# Altium project SAMV71_Xplained_Ultra.PrjPCB (part 4 of 4)

## Sheet SAMV71_Xplained_Ultra_MCU_Peripherals.SchDoc: Target MCU Peripherals
size A3; Organization: ATMEL Norway; Address1: Vestre Rosten 79; Address2: N-7075 TILLER; Address3: NORWAY; DocumentNumber: A09-2407; Revision: 11; SheetNumber: 6; SheetTotal: 13; DrawnBy: Microchip Norway; Engineer: AH; PageSetup: Record=PageOptions|CenterHorizontal=True|CenterVertical=True|PrintScale=1.01|XCorrection=1.00|YCorrection=1.00|PrintKind=1|BorderSize=5000000|LeftOffset=0|BottomOffset=0|Orientation=2|PaperLength=1000|PaperWidth=1000|Scale=100|PaperSource=7|PrintQuality=-4|MediaType=1|DitherType=10|PaperKind=A3 (297 x 420 mm)|PrintScaleMode=1; ProjectTitle: SAM V71 Xplained Ultra; PCBNumber: A08-2216; PCBRevision: 4
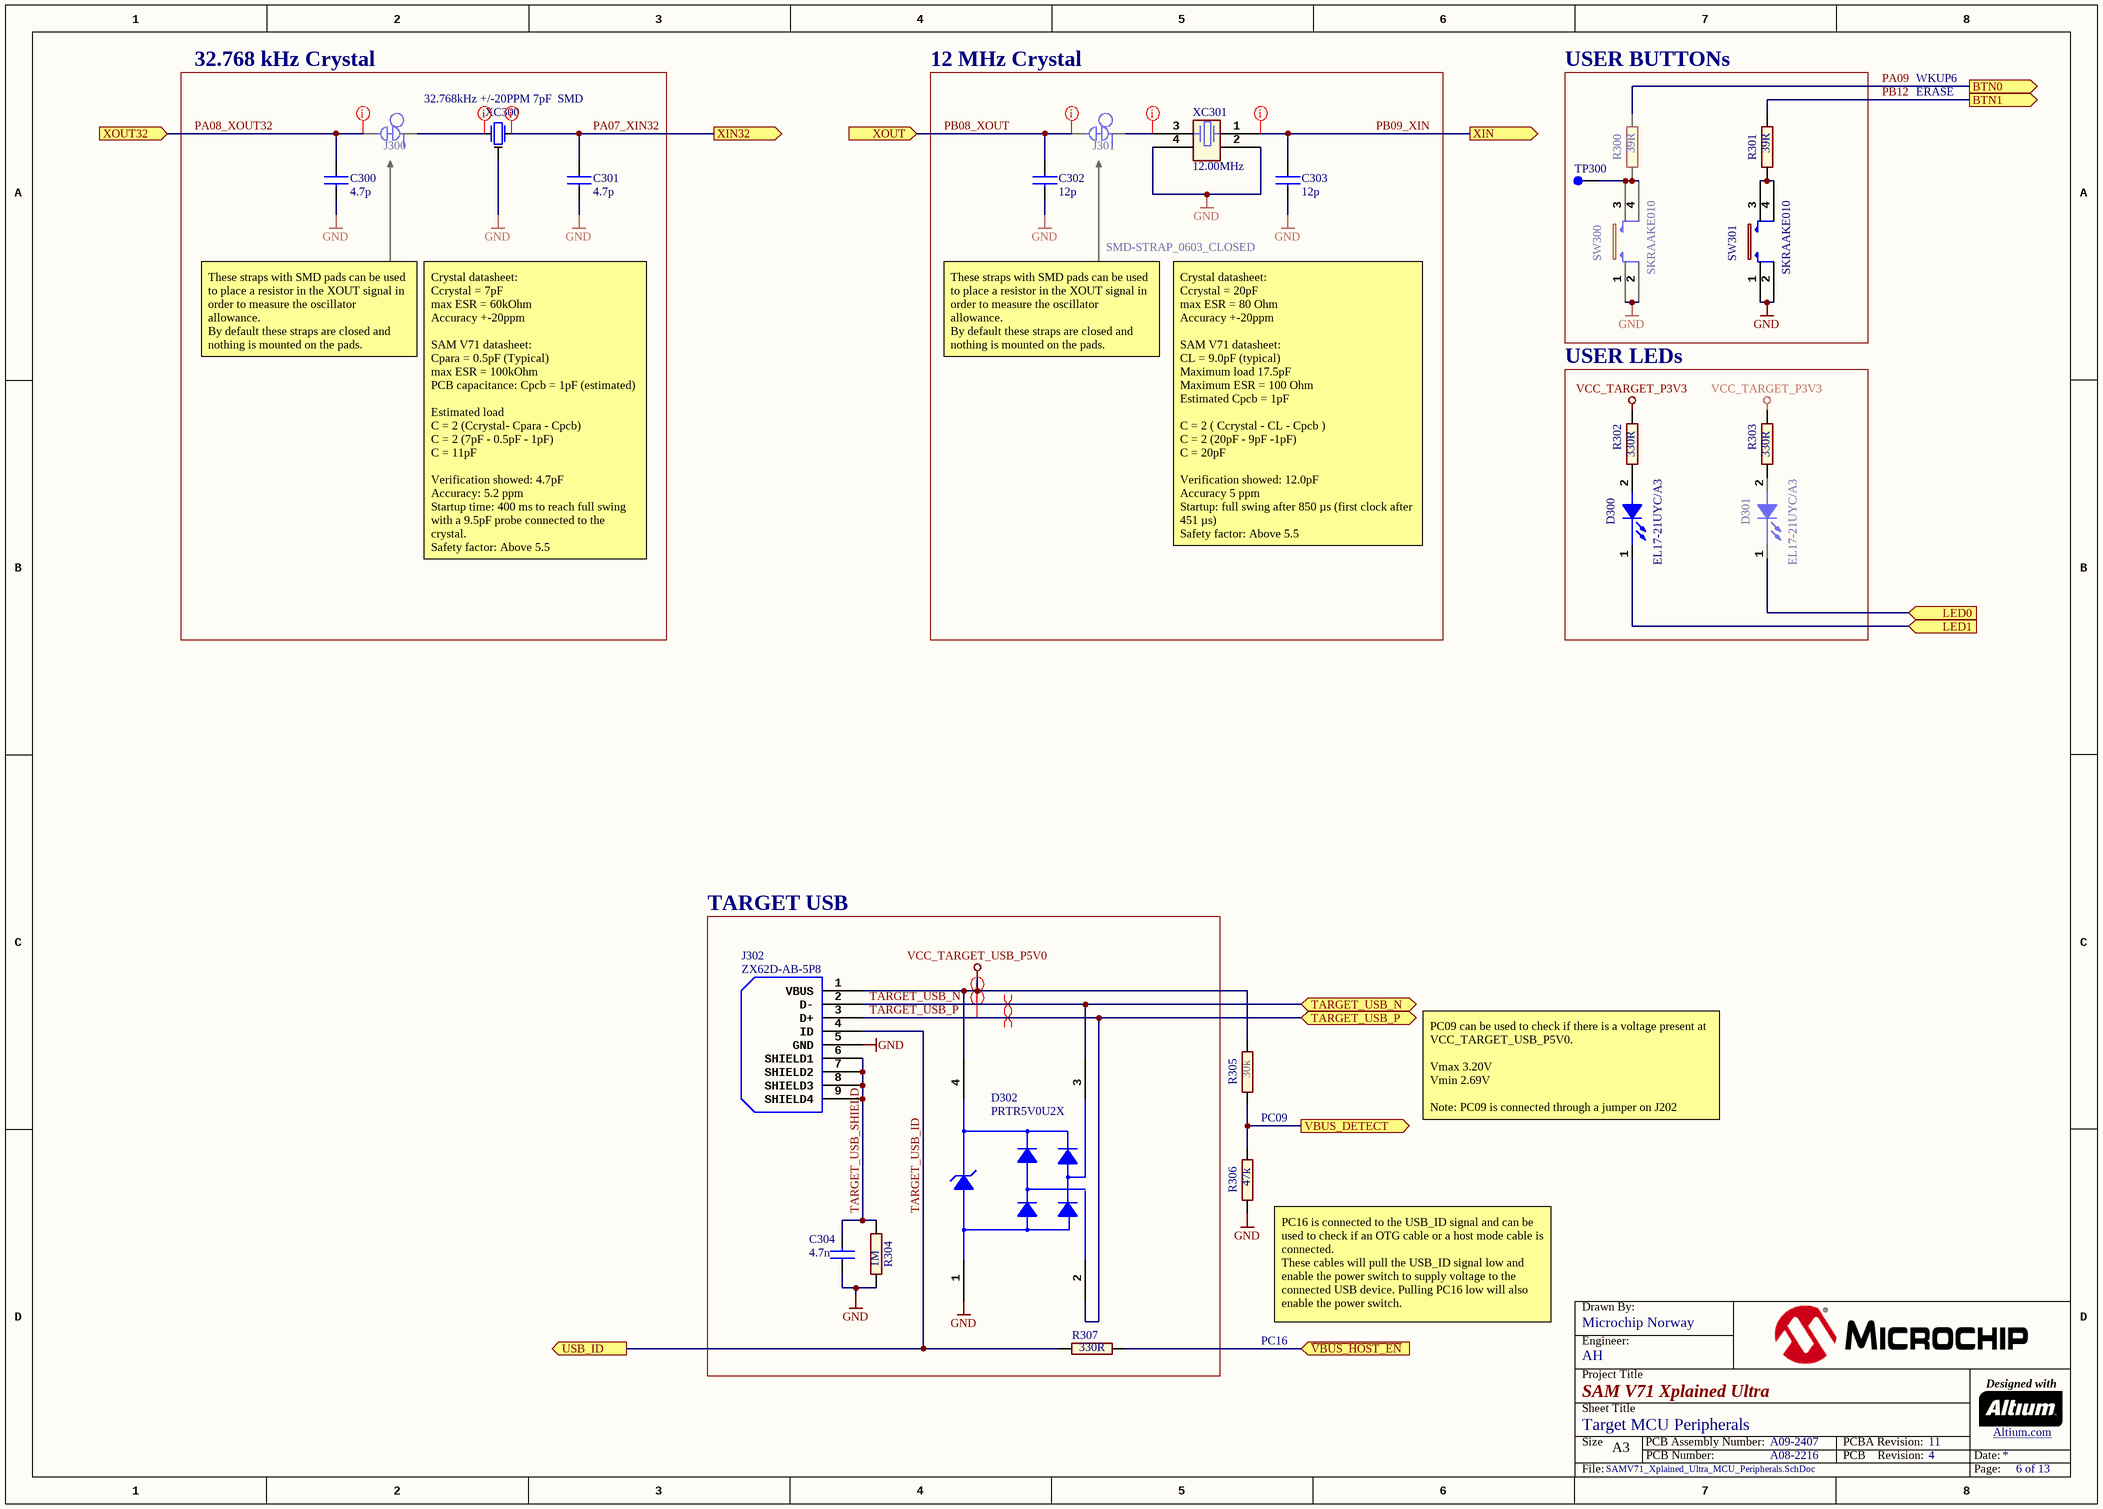
[diagram p11: SAMV71_Xplained_Ultra_MCU_Peripherals.SchDoc]

### Parts
C300  value 4.7p  [AP1-00001]
C301  value 4.7p  [AP1-00001]
C302  value 12p  [AP1-00001]
C303  value 12p  [AP1-00001]
C304  value 4.7n  [AP1-00053]
D300  value EL17-21UYC/A3  [AP4-00013]
D301  value EL17-21UYC/A3  [AP4-00013]
D302  value PRTR5V0U2X  [AP4-00001]
J300  (no value)  [AP9-00044]  (net tie, no BOM)
J301  value SMD-STRAP_0603_CLOSED  [AP9-00044]  (net tie, no BOM)
J302  value ZX62D-AB-5P8  [AP8-00852]  (hidden comment: 2,000 pieces per reel)
R300  value 39R  [AP2-00011]
R301  value 39R  [AP2-00011]
R302  value 330R  [AP2-00000]
R303  value 330R  [AP2-00000]
R304  value 1M  [AP2-00011]
R305  value 30k  [AP2-00000]
R306  value 47k  [AP2-00000]
R307  value 330R  [AP2-00000]
SW300  value SKRAAKE010  [AP8-00137]  (hidden comment: same as A08-0091 but less force is needed; Can be ordered in low volumes from Mouser)
SW301  value SKRAAKE010  [AP8-00137]  (hidden comment: same as A08-0091 but less force is needed; Can be ordered in low volumes from Mouser)
TP300  (no value)  [AP8-00010]  (no BOM)
XC300  value 32.768kHz +/-20PPM 7pF  SMD  [AP7-00044]  (hidden comment: Farnell order no:1539364)
XC301  value 12.00MHz  [AP7-00039]

### Blocks framed on the sheet
32.768 kHz Crystal: C300 C301 J300 XC300
12 MHz Crystal: C302 C303 J301 XC301
USER BUTTONs: R300 R301 SW300 SW301 TP300
USER LEDs: D300 D301 R302 R303
TARGET USB: C304 D302 J302 R304 R307

### Ports
BTN0 (out), BTN1 (out), LED0 (in), LED1 (in), TARGET_USB_N (bidir), TARGET_USB_P (bidir), USB_ID (out), VBUS_DETECT (out), XIN32 (out), XIN (out), XOUT32 (in), XOUT (in), ~{VBUS_HOST_EN} (in)

### Nets
GND: C300.2 C301.2 C302.2 C303.2 C304.1 D302.1(GND) J302.5(GND) R304.1 R306.1 SW300.1 SW300.2 SW301.1 SW301.2 XC300.3 XC301.2 XC301.4
VCC_TARGET_P3V3: R302.2 R303.2
VCC_TARGET_USB_P5V0: D302.4(VCC) J302.1(VBUS) R305.2
PA07_XIN32: C301.1 XC300.2 ; port XIN32
PA08_XOUT32: C300.1 J300.2 ; port XOUT32
PA09: R300.2 ; port BTN0
PA23: D301.1(CATHODE) ; port LED0
PB08_XOUT: C302.1 J301.2 ; port XOUT
PB09_XIN: C303.1 XC301.1 ; port XIN
PB12: R301.2 ; port BTN1
PC09_LED: D300.1(CATHODE) ; port LED1
PC09_VBUS_DETECT: R305.1 R306.2 ; port VBUS_DETECT
PC16: R307.2 ; port ~{VBUS_HOST_EN}
TARGET_USB_ID: J302.4(ID) R307.1 ; port USB_ID
TARGET_USB_N: D302.3(I/O_2) J302.2(D-) ; port TARGET_USB_N
TARGET_USB_P: D302.2(I/O_1) J302.3(D+) ; port TARGET_USB_P
TARGET_USB_SHIELD: C304.2 J302.6(SHIELD1) J302.7(SHIELD2) J302.8(SHIELD3) J302.9(SHIELD4) R304.2
NetD300_2: D300.2(ANODE) R302.1
NetD301_2: D301.2(ANODE) R303.1
NetJ300_1: J300.1 XC300.1
NetJ301_1: J301.1 XC301.3
NetR300_1: R300.1 SW300.3 SW300.4 TP300.1
NetR301_1: R301.1 SW301.3 SW301.4

### Layout directives
differential pair: TARGET_USB_N, TARGET_USB_P
rule Assembly Testpoint Usage [Testpoint - Not Allowed    Multiple - Not Allowed]; rule Fabrication Testpoint Usage [Testpoint - Not Allowed    Multiple - Not Allowed]: NetJ300_1, NetJ301_1, PA07_XIN32, PA08_XOUT32, PB08_XOUT, PB09_XIN, TARGET_USB_N, TARGET_USB_P

### Notes on the sheet
- WKUP6
- ERASE
- These straps with SMD pads can be used to place a resistor in the XOUT signal in order to measure the oscillator allowance.
  By default these straps are closed and nothing is mounted on the pads.
- Crystal datasheet:
  Ccrystal = 7pF
  max ESR = 60kOhm
  Accuracy +-20ppm
  SAM V71 datasheet:
  Cpara = 0.5pF (Typical)
  max ESR = 100kOhm
  PCB capacitance: Cpcb = 1pF (estimated)
  Estimated load
  C = 2 (Ccrystal- Cpara - Cpcb)
  C = 2 (7pF - 0.5pF - 1pF)
  C = 11pF
  Verification showed: 4.7pF
  Accuracy: 5.2 ppm
  Startup time: 400 ms to reach full swing with a 9.5pF probe connected to the crystal.
  Safety factor: Above 5.5
- Crystal datasheet:
  Ccrystal = 20pF
  max ESR = 80 Ohm
  Accuracy +-20ppm
  SAM V71 datasheet:
  CL = 9.0pF (typical)
  Maximum load 17.5pF
  Maximum ESR = 100 Ohm
  Estimated Cpcb = 1pF
  C = 2 ( Ccrystal - CL - Cpcb )
  C = 2 (20pF - 9pF -1pF)
  C = 20pF
  Verification showed: 12.0pF
  Accuracy 5 ppm
  Startup: full swing after 850 µs (first clock after 451 µs)
  Safety factor: Above 5.5
- PC09
- PC09 can be used to check if there is a voltage present at VCC_TARGET_USB_P5V0.
  Vmax 3.20V
  Vmin 2.69V
  Note: PC09 is connected through a jumper on J202
- (near R306) PC16 is connected to the USB_ID signal and can be used to check if an OTG cable or a host mode cable is connected.
  These cables will pull the USB_ID signal low and enable the power switch to supply voltage to the connected USB device. Pulling PC16 low will also enable the power switch.
- PC16
- Drawn By:
- Project Title
- Engineer:
- Designed with
- Sheet Title
- Size
- A3
- PCB Number:
- PCB Assembly Number:
- PCBA Revision:
- PCB    Revision:
- Date:
- Altium.com <http://go.altium.com/MicrochipLandingPage_Evaluation.html>
- File:
- Page:

### Library data of the parts
C300 C301 = A01-0011: Ceramic capacitor, SMD 0402, NP0, 50V, +/-0.25pF; PartGroup: Capacitors,Ceramic,SMD 0402; Manufacturer: YAGEO CORP; MPN: CC0402CRNPO9BN4R7; TemperatureRange: -55 - +125 deg C; Status: Active; AN: A01-0011; Tolerance: 50V, +/-0.25pF; Height: 0,550000011920929
C302 C303 = A01-0016: Ceramic capacitor, SMD 0402, NP0, 50V, +/-5%; PartGroup: Capacitors,Ceramic,SMD 0402; Manufacturer: Kemet; MPN: C0402C120J5GAC7867; TemperatureRange: -55 - +125 deg C; Status: Active; AN: A01-0016; Tolerance: 50V, +/-5%; Height: 0,550000011920929
C304 = A01-0046: Ceramic capacitor, SMD 0402, X7R, 25V, +/-10%; PartGroup: Capacitors,Ceramic,SMD 0402; Manufacturer: PHYCOMP; MPN: 2238 587 15632; TemperatureRange: -55 - +125 deg C; Status: Active; AN: A01-0046; Tolerance: 25V, +/-10%; Height: 0,550000011920929
D300 D301 = A10-0019: LED, Yellow, Wave length=591nm, SMD 0805, ±70°; PartGroup: Opto,LEDs,SMD; Manufacturer: Everlight; MPN: 17-21UYC/S530-A3/TR8; TemperatureRange: -40 to +85 deg C; Status: Active; AN: A10-0019; Height: 1,10000002384186
D302 = A06-0236: Double rail-to-rail USB ESD protection diode; OrcadPartType: Integrated Circuits&Special function&Protection; Manufacturer: NXP; PartGroup: Integrated Circuits,Special function,Protection; TemperatureRange: -40 to +85 C; Status: Active; AN: A06-0236; PartType: Buy; Height: 1,10000002384186; MPN: PRTR5V0U2X
J300 = A09-0783: Default closed SMD strap, 0603 size; PartGroup: Mechanical devices,PCB implemented components; Value: SMD-STRAP_0603_CLOSED; AN: A09-0783; Height: 0
J301 = A09-0783: Default closed SMD strap, 0603 size; PartGroup: Mechanical devices,PCB implemented components; AN: A09-0783; Height: 0
J302 = A08-2112: Micro USB AB Connector, Standard SMT + DIP; PartGroup: Mechanical devices,Connectors,USB; Manufacturer: HIROSE; MPN: ZX62D-AB-5P8(30); Status: Active; AN: A08-2112; Height: 2,79999995231628
R300 R301 = A02-0178: Thick film resistor, SMD 0402, 1/16W, 1%; PartGroup: Resistors,SMD,0402 1%; Manufacturer: ASJ; MPN: CR10-39R0-FK; TemperatureRange: -55 - +125 deg C; Status: Active; AN: A02-0178; Tolerance: 1 %; Height: 0,349999994039536
R302 R303 R307 = A02-0200: Thick film resistor, SMD 0402, 1/16W, 1%; PartGroup: Resistors,SMD,0402 1%; Manufacturer: ASJ; MPN: CR10-3300-FK; TemperatureRange: -55 - +125 deg C; Status: Active; AN: A02-0200; Tolerance: 1 %; Height: 0,349999994039536
R304 = A02-0284: Thick film resistor, SMD 0402, 1/16W, 1%; PartGroup: Resistors,SMD,0402 1%; Manufacturer: ASJ; MPN: CR10-1004-FK; TemperatureRange: -55 - +125 deg C; Status: Active; AN: A02-0284; Tolerance: 1 %; Height: 0,349999994039536
R305 = A02-0247: Thick film resistor, SMD 0402, 1/16W, 1%; PartGroup: Resistors,SMD,0402 1%; Manufacturer: ASJ; MPN: CR10-3002-FK; TemperatureRange: -55ï¿½ to +155ï¿½C; Status: Active; AN: A02-0247; Tolerance: 1 %; Height: 0,349999994039536
R306 = A02-0252: Thick film resistor, SMD 0402, 1/16W, 1%; PartGroup: Resistors,SMD,0402 1%; Manufacturer: KOA; MPN: RK73H1ETTP4702F; TemperatureRange: -55 - +125 deg C; Status: Active; AN: A02-0252; Tolerance: 1 %; Height: 0,349999994039536
SW300 SW301 = A08-0790: 6.2x6.2 mm SMD tact switch, same as A08-0091 but less force is needed; PartGroup: Mechanical devices,Switches,SMD; Manufacturer: ALPS; TemperatureRange: -30 - +90 deg C; Status: Active; AN: A08-0790; Height: 5,09999990463257; MPN: SKRAAKE010
TP300 = A08-0004: Single SMD testpad; PartGroup: Mechanical devices,Connectors,Test points; Status: Active; AN: A08-0004; Height: 0; Value: TESTPAD
XC300 = A07-0052: 32k768 crystal, +-20ppm, CL=7pF, max ESR 60kOhm, SMD; PartGroup: Frequency devices,Crystals,SMD; Manufacturer: Micro Crystal; MPN: MS1V-T1K 32.768kHz 7pF +/-20PPM TA; Tolerance: +/- 20 PPM; TemperatureRange: -40 /+85; AN: A07-0052; Height: 2,07999992370605
XC301 = A07-0042: Fox FQ5032B 12.0MHz SMD crystal 738B-12; PartGroup: Frequency devices,Crystals,SMD; Manufacturer: Fox  Electronics; MPN: FQ5032B-12.000; Tolerance: Â±30ppm; TemperatureRange: 0Â°C ~ 70Â°C; Status: Active; AN: A07-0042; Height: 1,20000004768372

## Sheet SAMV71_Xplained_Ultra_CAN.SchDoc: CAN
size A3; Organization: ATMEL Norway; Address1: Vestre Rosten 79; Address2: N-7075 TILLER; Address3: NORWAY; DocumentNumber: A09-2407; Revision: 11; SheetNumber: 12; SheetTotal: 13; DrawnBy: Microchip Norway; Engineer: AH; PageSetup: Record=PageOptions|CenterHorizontal=True|CenterVertical=True|PrintScale=1.01|XCorrection=1.00|YCorrection=1.00|PrintKind=1|BorderSize=5000000|LeftOffset=0|BottomOffset=0|Orientation=2|PaperLength=1000|PaperWidth=1000|Scale=100|PaperSource=7|PrintQuality=-4|MediaType=1|DitherType=10|PaperKind=A3 (297 x 420 mm)|PrintScaleMode=1; ProjectTitle: SAM V71 Xplained Ultra; PCBNumber: A08-2216; PCBRevision: 4; ProjectName: SAM3X Xplained Pro
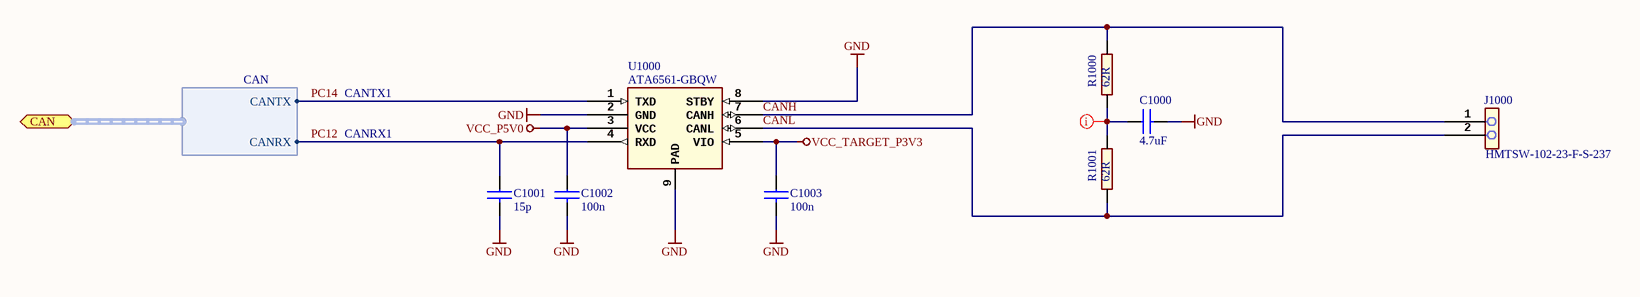
[diagram p12: SAMV71_Xplained_Ultra_CAN.SchDoc]

### Parts
C1000  value 4.7uF  [AP1-00003]
C1001  value 15p  [AP1-00001]
C1002  value 100n  [AP1-00001]
C1003  value 100n  [AP1-00001]
J1000  value HMTSW-102-23-F-S-237  [AP8-00733]
R1000  value 62R  [AP2-00008]  (hidden comment: Generic component)
R1001  value 62R  [AP2-00008]  (hidden comment: Generic component)
U1000  value ATA6561-GBQW  [AP6-00407]

### Ports
CAN (harness CAN)

### Harnesses
CAN: CANTX, CANRX

### Nets
GND: C1000.2 C1001.2 C1002.2 C1003.2 U1000.2(GND) U1000.8(STBY) U1000.9(PAD)
VCC_P5V0: C1002.1 U1000.3(VCC)
VCC_TARGET_P3V3: C1003.1 U1000.5(VIO)
CANH: J1000.1 R1000.2 U1000.7(CANH)
CANL: J1000.2 R1001.1 U1000.6(CANL)
PC12: C1001.1 U1000.4(RXD) ; port CAN.CANRX
PC14: U1000.1(TXD) ; port CAN.CANTX
NetC1000_1: C1000.1 R1000.1 R1001.2

### Layout directives
rule Fabrication Testpoint Usage [Testpoint - Not Allowed    Multiple - Not Allowed]; rule Assembly Testpoint Usage [Testpoint - Not Allowed    Multiple - Not Allowed]: NetC1000_1

### Notes on the sheet
- CANTX1
- CANRX1
- Drawn By:
- Project Title
- Engineer:
- Designed with
- Sheet Title
- Size
- A3
- PCB Number:
- PCB Assembly Number:
- PCBA Revision:
- PCB    Revision:
- Date:
- Altium.com <http://go.altium.com/MicrochipLandingPage_Evaluation.html>
- File:
- Page:

### Library data of the parts
C1000 = A01-0400: Ceramic capacitor, SMD 0805, X5R, 25V, ±10 %; PartGroup: Capacitors,Ceramic,SMD 0805; Manufacturer: Murata; MPN: GRM21BR61E475KA12L; Tolerance: Â±10%; Status: Active; AN: A01-0400; Height: 1,25
C1001 = A01-0017: Ceramic capacitor, SMD 0402, NP0, 50V, +/-5%; PartGroup: Capacitors,Ceramic,SMD 0402; Manufacturer: AVX; MPN: 04025A150JAT2A; TemperatureRange: -55 - +125 deg C; Status: Active; AN: A01-0017; Tolerance: 50V, +/-5%; Height: 0,550000011920929
C1002 C1003 = A01-0246: as C600-C602 on sheet SAMV71_Xplained_Ultra_Memory; Status: Active; AN: A01-0246; Tolerance: 16V, +/-10%; Height: 0,5
J1000 = A08-1754: 1x2 pin header, 2.54mm pitch, Pin-in-Paste THM; PartGroup: Mechanical devices,Connectors,Pin headers; Manufacturer: SAMTEC; TemperatureRange: - 55 deg C to + 125 deg C; Status: Active; AN: A08-1754; Height: 6,09999990463257; MPN: HMTSW-102-23-F-S-237
R1000 R1001 = A02-0760: Thick film resistor, SMD 1210, 0.5W, 1%; PartGroup: Resistors,SMD,1210 1%; Manufacturer: vishay; MPN: CRCW121062R0FKEAHP; TemperatureRange: -55°C to +155°C; Status: Active; AN: A02-0760; Tolerance: 1%; Height: 0,699999988079071
U1000 = A06-1172: 5Mbit/s CAN Trasceiver,VCC = 5V, VIO = 2.8-5V, 3x3 mm VDFN8; PartGroup: Integrated Circuits,Interface ICs,CAN; Manufacturer: ATMEL; Status: New; AN: A06-1172; Height: 0,899999976158142; MPN: ATA6561-GBQW

## Nets that join several sheets
GND: SAMV71_Xplained_Ultra_Target_MCU (28 pins), SAMV71_Xplained_Ultra_EDBG (35 pins), SAMV71_Xplained_Ultra_Connectors (40 pins), SAMV71_Xplained_Ultra_Power_Supply (35 pins), SAMV71_Xplained_Ultra_Power_Multiplexer (9 pins), SAMV71_Xplained_Ultra_Power_Converter (24 pins), SAMV71_Xplained_Ultra_Ethernet (28 pins), SAMV71_Xplained_Ultra_Memory (33 pins), SAMV71_Xplained_Ultra_Shield_Connectors (6 pins), SAMV71_Xplained_Ultra_Audio (17 pins), SAMV71_Xplained_Ultra_MCU_Peripherals (16 pins), SAMV71_Xplained_Ultra_CAN (7 pins)
VCC_BACKUP_P3V3: SAMV71_Xplained_Ultra_Power_Supply (J102.2 R106.2 U101.1), SAMV71_Xplained_Ultra_Power_Converter (Q106.2 R127.2)
VCC_EDBG_P3V3: SAMV71_Xplained_Ultra_EDBG (24 pins), SAMV71_Xplained_Ultra_Power_Supply (Q101.2 Q108.2 R141.2 R143.2)
VCC_EDBG_USB_P5V0: SAMV71_Xplained_Ultra_EDBG (C908.1 L900.2 U900.A10), SAMV71_Xplained_Ultra_Power_Multiplexer (C105.1 R116.2 U102.3 U102.8)
VCC_EXT_P5V0_P14V0: SAMV71_Xplained_Ultra_Connectors (J405.40), SAMV71_Xplained_Ultra_Power_Supply (6 pins), SAMV71_Xplained_Ultra_Shield_Connectors (J501.8)
VCC_IN_P5V0: SAMV71_Xplained_Ultra_Power_Supply (5 pins), SAMV71_Xplained_Ultra_Power_Multiplexer (Q104.3 R115.2 U102.2)
VCC_MCU_P3V3: SAMV71_Xplained_Ultra_Target_MCU (18 pins), SAMV71_Xplained_Ultra_Power_Supply (J102.1)
VCC_P1V2: SAMV71_Xplained_Ultra_Power_Converter (C120.1 R132.2 U104.23), SAMV71_Xplained_Ultra_Ethernet (6 pins)
VCC_P1V8: SAMV71_Xplained_Ultra_Power_Supply (R136.2), SAMV71_Xplained_Ultra_Power_Converter (C119.1 R128.2 U104.20), SAMV71_Xplained_Ultra_Audio (L805.1 L806.1 R819.1)
VCC_P3V3: SAMV71_Xplained_Ultra_EDBG (R920.2), SAMV71_Xplained_Ultra_Power_Supply (R100.1), SAMV71_Xplained_Ultra_Power_Converter (C116.1 C117.1 L102.2 R124.2)
VCC_P5V0: SAMV71_Xplained_Ultra_Power_Supply (5 pins), SAMV71_Xplained_Ultra_Power_Multiplexer (5 pins), SAMV71_Xplained_Ultra_Power_Converter (16 pins), SAMV71_Xplained_Ultra_Shield_Connectors (J501.5 J506.2 J507.1 J507.2), SAMV71_Xplained_Ultra_CAN (C1002.1 U1000.3)
VCC_TARGET_P3V3: SAMV71_Xplained_Ultra_Target_MCU (J200.1 R231.1 R232.1), SAMV71_Xplained_Ultra_Connectors (13 pins), SAMV71_Xplained_Ultra_Power_Supply (J101.4 R100.2 R102.2 U101.2), SAMV71_Xplained_Ultra_Power_Multiplexer (R120.1 R121.2), SAMV71_Xplained_Ultra_Power_Converter (R134.2), SAMV71_Xplained_Ultra_Ethernet (17 pins), SAMV71_Xplained_Ultra_Memory (38 pins), SAMV71_Xplained_Ultra_Shield_Connectors (J501.2 J501.4), SAMV71_Xplained_Ultra_Audio (6 pins), SAMV71_Xplained_Ultra_MCU_Peripherals (R302.2 R303.2), SAMV71_Xplained_Ultra_CAN (C1003.1 U1000.5)
VCC_TARGET_USB_P5V0: SAMV71_Xplained_Ultra_Power_Multiplexer (C106.1 R117.2 U102.6 U103.1), SAMV71_Xplained_Ultra_MCU_Peripherals (D302.4 J302.1 R305.2)
A0/NBS0: SAMV71_Xplained_Ultra_Target_MCU (R267.2), SAMV71_Xplained_Ultra_Memory (U601.J6)
A2: SAMV71_Xplained_Ultra_Target_MCU (R251.2), SAMV71_Xplained_Ultra_Memory (U601.N6)
A3: SAMV71_Xplained_Ultra_Target_MCU (R252.2), SAMV71_Xplained_Ultra_Memory (U601.P7)
A4: SAMV71_Xplained_Ultra_Target_MCU (R253.2), SAMV71_Xplained_Ultra_Memory (U601.P6)
A5: SAMV71_Xplained_Ultra_Target_MCU (R254.2), SAMV71_Xplained_Ultra_Memory (U601.R6)
A6: SAMV71_Xplained_Ultra_Target_MCU (R255.2), SAMV71_Xplained_Ultra_Memory (U601.R2)
A7: SAMV71_Xplained_Ultra_Target_MCU (R256.2), SAMV71_Xplained_Ultra_Memory (U601.P2)
A8: SAMV71_Xplained_Ultra_Target_MCU (R257.2), SAMV71_Xplained_Ultra_Memory (U601.P1)
A9: SAMV71_Xplained_Ultra_Target_MCU (R258.2), SAMV71_Xplained_Ultra_Memory (U601.N2)
A10: SAMV71_Xplained_Ultra_Target_MCU (R259.2), SAMV71_Xplained_Ultra_Memory (U601.N1)
A11: SAMV71_Xplained_Ultra_Target_MCU (R260.2), SAMV71_Xplained_Ultra_Memory (U601.M2)
ADVREF: SAMV71_Xplained_Ultra_Target_MCU (C218.1 L200.2 U200.9), SAMV71_Xplained_Ultra_Shield_Connectors (J500.8)
BA0: SAMV71_Xplained_Ultra_Target_MCU (R262.2), SAMV71_Xplained_Ultra_Memory (U601.M1)
CAS: SAMV71_Xplained_Ultra_Target_MCU (R263.2), SAMV71_Xplained_Ultra_Memory (U601.K7)
D0: SAMV71_Xplained_Ultra_Target_MCU (R235.2), SAMV71_Xplained_Ultra_Memory (R628.2 R629.1)
D0_LCD: SAMV71_Xplained_Ultra_Connectors (J404.3), SAMV71_Xplained_Ultra_Memory (R628.1)
D1: SAMV71_Xplained_Ultra_Target_MCU (R236.2), SAMV71_Xplained_Ultra_Memory (R627.2 R630.1)
D1_LCD: SAMV71_Xplained_Ultra_Connectors (J404.4), SAMV71_Xplained_Ultra_Memory (R627.1)
D2: SAMV71_Xplained_Ultra_Target_MCU (R237.2), SAMV71_Xplained_Ultra_Memory (R626.2 R631.1)
D2_LCD: SAMV71_Xplained_Ultra_Connectors (J404.5), SAMV71_Xplained_Ultra_Memory (R626.1)
D3: SAMV71_Xplained_Ultra_Target_MCU (R238.2), SAMV71_Xplained_Ultra_Memory (R625.2 R632.1)
D3_LCD: SAMV71_Xplained_Ultra_Connectors (J404.6), SAMV71_Xplained_Ultra_Memory (R625.1)
D4: SAMV71_Xplained_Ultra_Target_MCU (R239.2), SAMV71_Xplained_Ultra_Memory (R624.2 R633.1)
D4_LCD: SAMV71_Xplained_Ultra_Connectors (J404.8), SAMV71_Xplained_Ultra_Memory (R624.1)
D5: SAMV71_Xplained_Ultra_Target_MCU (R240.2), SAMV71_Xplained_Ultra_Memory (R623.2 R634.1)
D5_LCD: SAMV71_Xplained_Ultra_Connectors (J404.9), SAMV71_Xplained_Ultra_Memory (R623.1)
D6: SAMV71_Xplained_Ultra_Target_MCU (R241.2), SAMV71_Xplained_Ultra_Memory (R622.2 R635.1)
D6_LCD: SAMV71_Xplained_Ultra_Connectors (J404.10), SAMV71_Xplained_Ultra_Memory (R622.1)
D7: SAMV71_Xplained_Ultra_Target_MCU (R242.2), SAMV71_Xplained_Ultra_Memory (R621.2 R636.1)
D7_LCD: SAMV71_Xplained_Ultra_Connectors (J404.11), SAMV71_Xplained_Ultra_Memory (R621.1)
D8: SAMV71_Xplained_Ultra_Target_MCU (R243.2), SAMV71_Xplained_Ultra_Memory (R620.2 R637.1)
D8_LCD: SAMV71_Xplained_Ultra_Connectors (J404.13), SAMV71_Xplained_Ultra_Memory (R620.1)
D9: SAMV71_Xplained_Ultra_Target_MCU (R244.2), SAMV71_Xplained_Ultra_Memory (R619.2 R638.1)
D9_LCD: SAMV71_Xplained_Ultra_Connectors (J404.14), SAMV71_Xplained_Ultra_Memory (R619.1)
D10: SAMV71_Xplained_Ultra_Target_MCU (R245.2), SAMV71_Xplained_Ultra_Memory (R618.2 R639.1)
D10_LCD: SAMV71_Xplained_Ultra_Connectors (J404.15), SAMV71_Xplained_Ultra_Memory (R618.1)
D11: SAMV71_Xplained_Ultra_Target_MCU (R246.2), SAMV71_Xplained_Ultra_Memory (R617.2 R640.1)
D11_LCD: SAMV71_Xplained_Ultra_Connectors (J404.16), SAMV71_Xplained_Ultra_Memory (R617.1)
D12: SAMV71_Xplained_Ultra_Target_MCU (R247.2), SAMV71_Xplained_Ultra_Memory (R616.2 R641.1)
D12_LCD: SAMV71_Xplained_Ultra_Connectors (J404.18), SAMV71_Xplained_Ultra_Memory (R616.1)
D13: SAMV71_Xplained_Ultra_Target_MCU (R248.2), SAMV71_Xplained_Ultra_Memory (R615.2 R642.1)
D13_LCD: SAMV71_Xplained_Ultra_Connectors (J404.19), SAMV71_Xplained_Ultra_Memory (R615.1)
D14: SAMV71_Xplained_Ultra_Target_MCU (R249.2), SAMV71_Xplained_Ultra_Memory (R614.2 R643.1)
D14_LCD: SAMV71_Xplained_Ultra_Connectors (J404.20), SAMV71_Xplained_Ultra_Memory (R614.1)
D15: SAMV71_Xplained_Ultra_Target_MCU (R250.2), SAMV71_Xplained_Ultra_Memory (R613.2 R644.1)
D15_LCD: SAMV71_Xplained_Ultra_Connectors (J404.21), SAMV71_Xplained_Ultra_Memory (R613.1)
EDBG_ADC0: SAMV71_Xplained_Ultra_EDBG (U900.K10), SAMV71_Xplained_Ultra_Power_Supply (R102.1 R103.2)
EDBG_TARGET_RESET: SAMV71_Xplained_Ultra_EDBG (U900.B4), SAMV71_Xplained_Ultra_Power_Supply (Q101.3 R143.1)
ID1: SAMV71_Xplained_Ultra_EDBG (R903.1 U900.A1), SAMV71_Xplained_Ultra_Connectors (J401.1)
ID2: SAMV71_Xplained_Ultra_EDBG (R902.1 U900.B2), SAMV71_Xplained_Ultra_Connectors (J402.1)
ID4: SAMV71_Xplained_Ultra_EDBG (R901.1 U900.D3), SAMV71_Xplained_Ultra_Connectors (J404.1)
NetJ400_18: SAMV71_Xplained_Ultra_Target_MCU (R214.1), SAMV71_Xplained_Ultra_Connectors (J400.18)
NetJ401_13: SAMV71_Xplained_Ultra_Target_MCU (R201.2), SAMV71_Xplained_Ultra_Connectors (J401.13)
NetJ401_14: SAMV71_Xplained_Ultra_Target_MCU (R202.2), SAMV71_Xplained_Ultra_Connectors (J401.14)
NetJ401_18: SAMV71_Xplained_Ultra_Target_MCU (R204.2), SAMV71_Xplained_Ultra_Connectors (J401.18)
NetJ402_8: SAMV71_Xplained_Ultra_Target_MCU (R209.2), SAMV71_Xplained_Ultra_Connectors (J402.8)
NetJ402_18: SAMV71_Xplained_Ultra_Target_MCU (R212.2), SAMV71_Xplained_Ultra_Connectors (J402.18)
NetJ404_44: SAMV71_Xplained_Ultra_Target_MCU (R203.1), SAMV71_Xplained_Ultra_Connectors (J404.44)
NetJ500_6: SAMV71_Xplained_Ultra_Target_MCU (R205.2), SAMV71_Xplained_Ultra_Shield_Connectors (J500.6)
NetJ502_1: SAMV71_Xplained_Ultra_Target_MCU (R215.2), SAMV71_Xplained_Ultra_Shield_Connectors (J502.1)
NetJ502_6: SAMV71_Xplained_Ultra_Target_MCU (R216.2), SAMV71_Xplained_Ultra_Shield_Connectors (J502.6)
NetJ502_7: SAMV71_Xplained_Ultra_Target_MCU (R217.2), SAMV71_Xplained_Ultra_Shield_Connectors (J502.7)
NetJ502_8: SAMV71_Xplained_Ultra_Target_MCU (R218.2), SAMV71_Xplained_Ultra_Shield_Connectors (J502.8)
NetJ504_1: SAMV71_Xplained_Ultra_Target_MCU (R219.2), SAMV71_Xplained_Ultra_Shield_Connectors (J504.1)
NetJ504_2: SAMV71_Xplained_Ultra_Target_MCU (R220.2), SAMV71_Xplained_Ultra_Shield_Connectors (J504.2)
NetJ504_3: SAMV71_Xplained_Ultra_Target_MCU (R221.2), SAMV71_Xplained_Ultra_Shield_Connectors (J504.3)
NetJ504_4: SAMV71_Xplained_Ultra_Target_MCU (R222.2), SAMV71_Xplained_Ultra_Shield_Connectors (J504.4)
NetJ505_5: SAMV71_Xplained_Ultra_Target_MCU (R210.2), SAMV71_Xplained_Ultra_Shield_Connectors (J505.5)
NetJ505_6: SAMV71_Xplained_Ultra_Target_MCU (R234.2), SAMV71_Xplained_Ultra_Shield_Connectors (J505.6)
NetJ505_7: SAMV71_Xplained_Ultra_Target_MCU (R208.2), SAMV71_Xplained_Ultra_Shield_Connectors (J505.7)
NetJ505_8: SAMV71_Xplained_Ultra_Target_MCU (R207.2), SAMV71_Xplained_Ultra_Shield_Connectors (J505.8)
NetJ506_3: SAMV71_Xplained_Ultra_Target_MCU (R227.2), SAMV71_Xplained_Ultra_Shield_Connectors (J506.3)
NetJ507_4: SAMV71_Xplained_Ultra_Target_MCU (R211.2), SAMV71_Xplained_Ultra_Shield_Connectors (J507.4)
NetJ507_5: SAMV71_Xplained_Ultra_Target_MCU (R213.2), SAMV71_Xplained_Ultra_Shield_Connectors (J507.5)
NetR200_2: SAMV71_Xplained_Ultra_Target_MCU (R200.2), SAMV71_Xplained_Ultra_Audio (U800.1)
NetR206_1: SAMV71_Xplained_Ultra_Target_MCU (R206.1), SAMV71_Xplained_Ultra_EDBG (U900.J4)
NetR223_2: SAMV71_Xplained_Ultra_Target_MCU (R223.2 R226.2), SAMV71_Xplained_Ultra_Audio (U800.30)
NetR224_2: SAMV71_Xplained_Ultra_Target_MCU (R224.2), SAMV71_Xplained_Ultra_Audio (U800.29)
NetR225_2: SAMV71_Xplained_Ultra_Target_MCU (R225.2), SAMV71_Xplained_Ultra_Audio (R817.2)
NetR228_2: SAMV71_Xplained_Ultra_Target_MCU (R228.2), SAMV71_Xplained_Ultra_Audio (U800.31)
NetR229_2: SAMV71_Xplained_Ultra_Target_MCU (R229.2), SAMV71_Xplained_Ultra_Audio (U800.32)
NetR230_2: SAMV71_Xplained_Ultra_Target_MCU (R230.2), SAMV71_Xplained_Ultra_Audio (U801.5)
NWR1/NBS1: SAMV71_Xplained_Ultra_Target_MCU (R269.2), SAMV71_Xplained_Ultra_Memory (U601.J2)
PA00: SAMV71_Xplained_Ultra_Target_MCU (U200.102), SAMV71_Xplained_Ultra_Connectors (J401.7), SAMV71_Xplained_Ultra_Shield_Connectors (J503.3)
PA01: SAMV71_Xplained_Ultra_Target_MCU (U200.99), SAMV71_Xplained_Ultra_Power_Converter (R134.1 U104.3)
PA02: SAMV71_Xplained_Ultra_Target_MCU (U200.93), SAMV71_Xplained_Ultra_EDBG (R914.1), SAMV71_Xplained_Ultra_Connectors (J402.9 J404.45 J405.16), SAMV71_Xplained_Ultra_Shield_Connectors (J503.8)
PA03: SAMV71_Xplained_Ultra_Target_MCU (R232.2 U200.91), SAMV71_Xplained_Ultra_EDBG (U900.G7), SAMV71_Xplained_Ultra_Connectors (5 pins), SAMV71_Xplained_Ultra_Memory (U600.5 U602.5 U603.5), SAMV71_Xplained_Ultra_Shield_Connectors (J500.9), SAMV71_Xplained_Ultra_Audio (U800.3 U801.10)
PA04: SAMV71_Xplained_Ultra_Target_MCU (R231.2 U200.77), SAMV71_Xplained_Ultra_EDBG (U900.F7), SAMV71_Xplained_Ultra_Connectors (5 pins), SAMV71_Xplained_Ultra_Memory (U600.6 U602.6 U603.6), SAMV71_Xplained_Ultra_Shield_Connectors (J500.10), SAMV71_Xplained_Ultra_Audio (U800.2 U801.9)
PA05: SAMV71_Xplained_Ultra_Target_MCU (U200.73), SAMV71_Xplained_Ultra_Connectors (J400.22 J401.10), SAMV71_Xplained_Ultra_Shield_Connectors (J500.1)
PA06: SAMV71_Xplained_Ultra_Target_MCU (U200.114), SAMV71_Xplained_Ultra_Connectors (J400.10 J402.5 J405.25), SAMV71_Xplained_Ultra_Shield_Connectors (J503.4)
PA07_XIN32: SAMV71_Xplained_Ultra_Target_MCU (U200.35), SAMV71_Xplained_Ultra_MCU_Peripherals (C301.1 XC300.2)
PA08_XOUT32: SAMV71_Xplained_Ultra_Target_MCU (U200.36), SAMV71_Xplained_Ultra_MCU_Peripherals (C300.1 J300.2)
PA09: SAMV71_Xplained_Ultra_Target_MCU (U200.75), SAMV71_Xplained_Ultra_EDBG (R911.1), SAMV71_Xplained_Ultra_Connectors (J400.21), SAMV71_Xplained_Ultra_MCU_Peripherals (R300.2)
PA11: SAMV71_Xplained_Ultra_Target_MCU (U200.64), SAMV71_Xplained_Ultra_Memory (R605.2 U604.1)
PA12: SAMV71_Xplained_Ultra_Target_MCU (U200.68), SAMV71_Xplained_Ultra_Memory (U604.2)
PA13: SAMV71_Xplained_Ultra_Target_MCU (U200.42), SAMV71_Xplained_Ultra_Memory (U604.5)
PA14: SAMV71_Xplained_Ultra_Target_MCU (U200.51), SAMV71_Xplained_Ultra_Memory (U604.6)
PA17: SAMV71_Xplained_Ultra_Target_MCU (U200.25), SAMV71_Xplained_Ultra_Memory (U604.3)
PA18: SAMV71_Xplained_Ultra_Target_MCU (U200.24), SAMV71_Xplained_Ultra_Shield_Connectors (J507.3), SAMV71_Xplained_Ultra_Audio (C800.2 R801.1)
PA19: SAMV71_Xplained_Ultra_Target_MCU (U200.23), SAMV71_Xplained_Ultra_Connectors (J401.4), SAMV71_Xplained_Ultra_Ethernet (R706.1 R720.1 U700.29), SAMV71_Xplained_Ultra_Shield_Connectors (J502.3)
PA21: SAMV71_Xplained_Ultra_Target_MCU (U200.32), SAMV71_Xplained_Ultra_EDBG (R910.1), SAMV71_Xplained_Ultra_Connectors (J402.13), SAMV71_Xplained_Ultra_Shield_Connectors (J507.27)
PA23: SAMV71_Xplained_Ultra_Target_MCU (U200.46), SAMV71_Xplained_Ultra_EDBG (R912.1), SAMV71_Xplained_Ultra_MCU_Peripherals (D301.1)
PA24: SAMV71_Xplained_Ultra_Target_MCU (U200.56), SAMV71_Xplained_Ultra_Connectors (J400.16 J402.10), SAMV71_Xplained_Ultra_Shield_Connectors (J507.26)
PA25: SAMV71_Xplained_Ultra_Target_MCU (U200.59), SAMV71_Xplained_Ultra_Memory (J600.5), SAMV71_Xplained_Ultra_Shield_Connectors (J507.25)
PA26: SAMV71_Xplained_Ultra_Target_MCU (U200.62), SAMV71_Xplained_Ultra_Memory (J600.9 R608.1)
PA27: SAMV71_Xplained_Ultra_Target_MCU (U200.70), SAMV71_Xplained_Ultra_Connectors (J400.25), SAMV71_Xplained_Ultra_Memory (J600.1 R607.1)
PA28: SAMV71_Xplained_Ultra_Target_MCU (U200.112), SAMV71_Xplained_Ultra_Memory (J600.2 R606.1)
PA29: SAMV71_Xplained_Ultra_Target_MCU (U200.129), SAMV71_Xplained_Ultra_Ethernet (U700.32)
PA30: SAMV71_Xplained_Ultra_Target_MCU (U200.116), SAMV71_Xplained_Ultra_Memory (J600.7 R610.1)
PA31: SAMV71_Xplained_Ultra_Target_MCU (U200.118), SAMV71_Xplained_Ultra_Memory (J600.8 R609.1)
PB02: SAMV71_Xplained_Ultra_Target_MCU (U200.26), SAMV71_Xplained_Ultra_Connectors (J401.6 J405.34), SAMV71_Xplained_Ultra_Shield_Connectors (J504.8 J507.20)
PB03: SAMV71_Xplained_Ultra_Target_MCU (U200.31), SAMV71_Xplained_Ultra_Connectors (J400.20 J401.5 J405.27), SAMV71_Xplained_Ultra_Shield_Connectors (J504.7 J507.21)
PB04: SAMV71_Xplained_Ultra_Target_MCU (U200.105), SAMV71_Xplained_Ultra_EDBG (U900.F9), SAMV71_Xplained_Ultra_Connectors (J402.14 J405.2), SAMV71_Xplained_Ultra_Shield_Connectors (J507.28)
PB05: SAMV71_Xplained_Ultra_Target_MCU (U200.109), SAMV71_Xplained_Ultra_EDBG (R921.2), SAMV71_Xplained_Ultra_Connectors (J403.6 J405.10 R403.2)
PB06_SWDIO: SAMV71_Xplained_Ultra_Target_MCU (U200.79), SAMV71_Xplained_Ultra_EDBG (R905.2), SAMV71_Xplained_Ultra_Connectors (J403.2 R400.2)
PB07_SWCLK: SAMV71_Xplained_Ultra_Target_MCU (U200.89), SAMV71_Xplained_Ultra_EDBG (R904.2), SAMV71_Xplained_Ultra_Connectors (J403.4 R401.2)
PB08_XOUT: SAMV71_Xplained_Ultra_Target_MCU (U200.141), SAMV71_Xplained_Ultra_MCU_Peripherals (C302.1 J301.2)
PB09_XIN: SAMV71_Xplained_Ultra_Target_MCU (U200.142), SAMV71_Xplained_Ultra_MCU_Peripherals (C303.1 XC301.1)
PB12: SAMV71_Xplained_Ultra_Target_MCU (J200.2 U200.87), SAMV71_Xplained_Ultra_EDBG (R900.2), SAMV71_Xplained_Ultra_MCU_Peripherals (R301.2)
PB13: SAMV71_Xplained_Ultra_Target_MCU (U200.144), SAMV71_Xplained_Ultra_Connectors (J400.5), SAMV71_Xplained_Ultra_Shield_Connectors (J504.5)
PC08: SAMV71_Xplained_Ultra_Target_MCU (U200.82), SAMV71_Xplained_Ultra_Connectors (J404.35)
PC09_LED: SAMV71_Xplained_Ultra_Target_MCU (J202.1), SAMV71_Xplained_Ultra_Connectors (J404.46), SAMV71_Xplained_Ultra_Shield_Connectors (J500.2), SAMV71_Xplained_Ultra_MCU_Peripherals (D300.1)
PC09_VBUS_DETECT: SAMV71_Xplained_Ultra_Target_MCU (J202.3), SAMV71_Xplained_Ultra_MCU_Peripherals (R305.1 R306.2)
PC10: SAMV71_Xplained_Ultra_Target_MCU (U200.90), SAMV71_Xplained_Ultra_Ethernet (C713.1 R702.1 U700.28)
PC11: SAMV71_Xplained_Ultra_Target_MCU (U200.94), SAMV71_Xplained_Ultra_Connectors (J404.36)
PC12: SAMV71_Xplained_Ultra_Target_MCU (U200.17), SAMV71_Xplained_Ultra_Shield_Connectors (J507.33), SAMV71_Xplained_Ultra_CAN (C1001.1 U1000.4)
PC13: SAMV71_Xplained_Ultra_Target_MCU (U200.19), SAMV71_Xplained_Ultra_Connectors (J402.4 J404.47), SAMV71_Xplained_Ultra_Shield_Connectors (J502.5)
PC14: SAMV71_Xplained_Ultra_Target_MCU (U200.97), SAMV71_Xplained_Ultra_Shield_Connectors (J507.34), SAMV71_Xplained_Ultra_CAN (U1000.1)
PC16: SAMV71_Xplained_Ultra_Target_MCU (U200.100), SAMV71_Xplained_Ultra_MCU_Peripherals (R307.2)
PC17: SAMV71_Xplained_Ultra_Target_MCU (U200.103), SAMV71_Xplained_Ultra_Power_Converter (Q106.1 R127.1)
PC19: SAMV71_Xplained_Ultra_Target_MCU (U200.117), SAMV71_Xplained_Ultra_Connectors (J400.6 J402.7), SAMV71_Xplained_Ultra_Shield_Connectors (J503.7)
PC30: SAMV71_Xplained_Ultra_Target_MCU (U200.15), SAMV71_Xplained_Ultra_Connectors (J401.8 J404.33)
PC31: SAMV71_Xplained_Ultra_Target_MCU (U200.14), SAMV71_Xplained_Ultra_Connectors (J401.3), SAMV71_Xplained_Ultra_Shield_Connectors (J502.2)
PD00: SAMV71_Xplained_Ultra_Target_MCU (U200.1), SAMV71_Xplained_Ultra_Ethernet (R711.1 U700.19), SAMV71_Xplained_Ultra_Shield_Connectors (J504.6)
PD01: SAMV71_Xplained_Ultra_Target_MCU (U200.132), SAMV71_Xplained_Ultra_Ethernet (U700.21)
PD02: SAMV71_Xplained_Ultra_Target_MCU (U200.131), SAMV71_Xplained_Ultra_Ethernet (U700.22)
PD03: SAMV71_Xplained_Ultra_Target_MCU (U200.128), SAMV71_Xplained_Ultra_Ethernet (U700.23)
PD04: SAMV71_Xplained_Ultra_Target_MCU (U200.126), SAMV71_Xplained_Ultra_Connectors (J403.14), SAMV71_Xplained_Ultra_Ethernet (R713.1 R718.2 U700.13)
PD05: SAMV71_Xplained_Ultra_Target_MCU (U200.125), SAMV71_Xplained_Ultra_Connectors (J403.16), SAMV71_Xplained_Ultra_Ethernet (R705.1 R719.1 U700.18)
PD06: SAMV71_Xplained_Ultra_Target_MCU (U200.121), SAMV71_Xplained_Ultra_Connectors (J403.18), SAMV71_Xplained_Ultra_Ethernet (R708.1 R715.1 U700.17)
PD07: SAMV71_Xplained_Ultra_Target_MCU (U200.119), SAMV71_Xplained_Ultra_Connectors (J403.20), SAMV71_Xplained_Ultra_Ethernet (R707.1 R714.1 U700.12)
PD08: SAMV71_Xplained_Ultra_Target_MCU (U200.113), SAMV71_Xplained_Ultra_Connectors (J403.12), SAMV71_Xplained_Ultra_Ethernet (U700.11)
PD09: SAMV71_Xplained_Ultra_Target_MCU (U200.110), SAMV71_Xplained_Ultra_Ethernet (R700.1 U700.10)
PD10: SAMV71_Xplained_Ultra_Target_MCU (U200.101), SAMV71_Xplained_Ultra_Connectors (J405.6)
PD11: SAMV71_Xplained_Ultra_Target_MCU (R200.1 U200.98), SAMV71_Xplained_Ultra_Connectors (J400.23 J402.6), SAMV71_Xplained_Ultra_Shield_Connectors (J503.6)
PD12: SAMV71_Xplained_Ultra_Target_MCU (U200.92), SAMV71_Xplained_Ultra_EDBG (U900.G5), SAMV71_Xplained_Ultra_Connectors (J400.24)
PD18: SAMV71_Xplained_Ultra_Target_MCU (U200.69), SAMV71_Xplained_Ultra_Memory (J600.10 R611.1), SAMV71_Xplained_Ultra_Shield_Connectors (J505.3 J507.8)
PD19: SAMV71_Xplained_Ultra_Target_MCU (U200.67), SAMV71_Xplained_Ultra_Connectors (J404.34), SAMV71_Xplained_Ultra_Shield_Connectors (J505.4 J507.7)
PD20: SAMV71_Xplained_Ultra_Target_MCU (U200.65), SAMV71_Xplained_Ultra_EDBG (R915.2), SAMV71_Xplained_Ultra_Connectors (J401.17 J402.17), SAMV71_Xplained_Ultra_Shield_Connectors (J500.5 J506.1)
PD21: SAMV71_Xplained_Ultra_Target_MCU (R230.1 U200.63), SAMV71_Xplained_Ultra_EDBG (U900.K3), SAMV71_Xplained_Ultra_Connectors (J400.19 J401.16 J402.16), SAMV71_Xplained_Ultra_Shield_Connectors (J500.4 J506.4)
PD24: SAMV71_Xplained_Ultra_Target_MCU (R219.1 R223.1 U200.55), SAMV71_Xplained_Ultra_Connectors (J400.14)
PD25: SAMV71_Xplained_Ultra_Target_MCU (U200.52), SAMV71_Xplained_Ultra_Connectors (J400.12 J401.15), SAMV71_Xplained_Ultra_Shield_Connectors (J500.3)
PD27: SAMV71_Xplained_Ultra_Target_MCU (U200.47), SAMV71_Xplained_Ultra_Connectors (J400.26 J402.15), SAMV71_Xplained_Ultra_Shield_Connectors (J503.5 J505.2)
PD28: SAMV71_Xplained_Ultra_Target_MCU (R203.2 U200.71), SAMV71_Xplained_Ultra_EDBG (R913.1), SAMV71_Xplained_Ultra_Connectors (J400.27 J401.9), SAMV71_Xplained_Ultra_Shield_Connectors (J503.1 J505.1)
PD30: SAMV71_Xplained_Ultra_Target_MCU (U200.34), SAMV71_Xplained_Ultra_Connectors (J400.28 J402.3), SAMV71_Xplained_Ultra_Shield_Connectors (J502.4 J503.2)
PD31: SAMV71_Xplained_Ultra_Target_MCU (U200.2), SAMV71_Xplained_Ultra_Connectors (J400.29), SAMV71_Xplained_Ultra_Memory (U604.7)
RAS: SAMV71_Xplained_Ultra_Target_MCU (R268.2), SAMV71_Xplained_Ultra_Memory (U601.K6)
SDA10: SAMV71_Xplained_Ultra_Target_MCU (R261.2), SAMV71_Xplained_Ultra_Memory (U601.N7)
SDCK: SAMV71_Xplained_Ultra_Target_MCU (R265.2), SAMV71_Xplained_Ultra_Memory (U601.K2)
SDCKE: SAMV71_Xplained_Ultra_Target_MCU (R264.2), SAMV71_Xplained_Ultra_Memory (U601.L1)
SDCS: SAMV71_Xplained_Ultra_Target_MCU (R266.2), SAMV71_Xplained_Ultra_Memory (R604.2 U601.L7)
SDWE: SAMV71_Xplained_Ultra_Target_MCU (R270.2), SAMV71_Xplained_Ultra_Memory (U601.J7)
TARGET_RESET: SAMV71_Xplained_Ultra_Target_MCU (U200.83), SAMV71_Xplained_Ultra_Connectors (J403.10 R402.2), SAMV71_Xplained_Ultra_Power_Supply (5 pins), SAMV71_Xplained_Ultra_Shield_Connectors (J501.3 J506.5)
TARGET_RESET_SENSE: SAMV71_Xplained_Ultra_EDBG (U900.H2), SAMV71_Xplained_Ultra_Power_Supply (R139.1 R141.1)
TARGET_USB_ID: SAMV71_Xplained_Ultra_Power_Multiplexer (R121.1 U103.4), SAMV71_Xplained_Ultra_MCU_Peripherals (J302.4 R307.1)
TARGET_USB_N: SAMV71_Xplained_Ultra_Target_MCU (U200.136), SAMV71_Xplained_Ultra_MCU_Peripherals (D302.3 J302.2)
TARGET_USB_P: SAMV71_Xplained_Ultra_Target_MCU (U200.137), SAMV71_Xplained_Ultra_MCU_Peripherals (D302.2 J302.3)
VBAT: SAMV71_Xplained_Ultra_Power_Supply (R112.1), SAMV71_Xplained_Ultra_Shield_Connectors (J501.1)

## Assembly variants
Default_assembly: not fitted C304 C601 C602 C800 C806 C807 C903 R112 R210 R216 R217 R218 R222 R234 R304 R705 R707 R708 R709 R717 R718 R720 R809 R810 R812 R813 R919 U602 U603